# Altium schematic sheet Sheet1.SchDoc: SCHEMA
size A4; Date: 01/01/2000; Author: Rachid AKKOUCHE; CompanyName: RASoftware; DrawnBy: Rachid AKKOUCHE; Engineer: Rachid AKKOUCHE; Organization: RASoftware; Address1: 52J-03 rue de la crèche; Address3: 77100 MEAUX; Address4: FRANCE; DocumentNumber: 01; Revision: A; SheetNumber: 1; SheetTotal: 1; Dessinepar: Rachid AKKOUCHE; Property: RASoftware; Time: 00:00; ProjectName: Projet BRA; Application_BuildNumber: 01
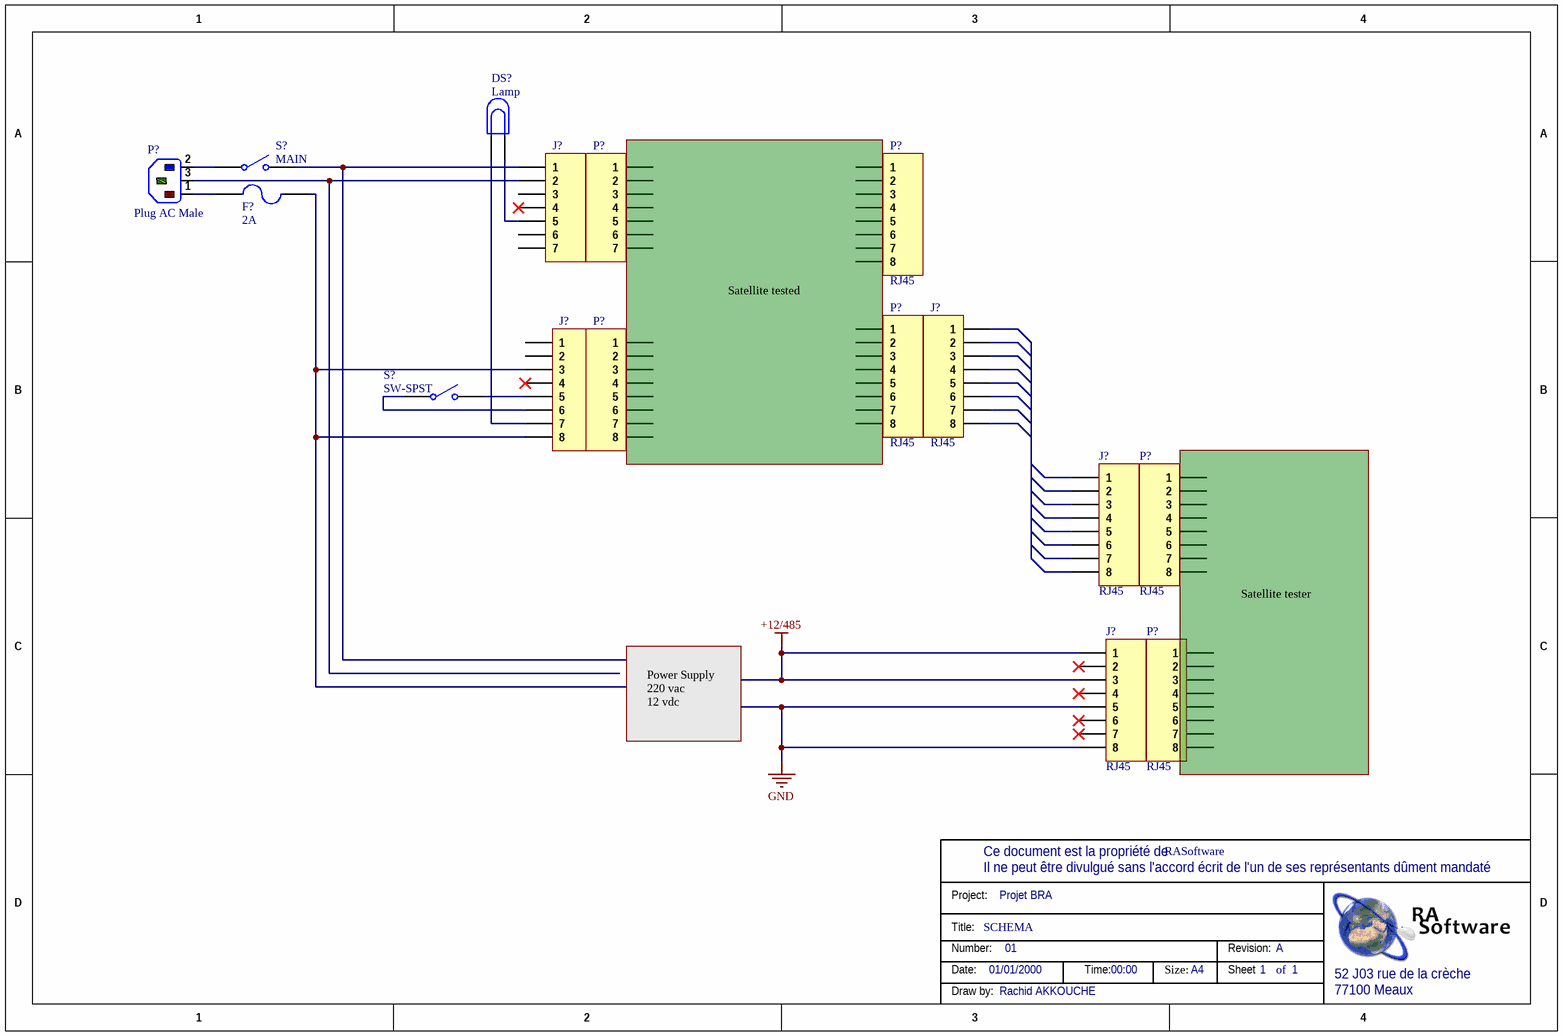
[diagram p0: Sheet1.SchDoc]

## Parts
(Parts that share a designator on the sheet are numbered #1, #2 ... from top to bottom, then left to right.)
DS?  Lamp  [PIN2]
F?  2A  [PIN-W2/E2.8]
J?#1  Header 7  [CO7P508-90]  (value not drawn)
J?#2  RJ45  [AMPHENOL-RJ45_8]
J?#3  Header 8  [CO8P508 - 90°]  (value not drawn)
J?#4  RJ45  [AMPHENOL-RJ45_8]
J?#5  RJ45  [AMPHENOL-RJ45_8]
P?#1  Header 7  [CO7P508-90]  (value not drawn)
P?#2  RJ45  [AMPHENOL-RJ45_8]
P?#3  Plug AC Male  [IEC9.14-2H3]
P?#4  RJ45  [AMPHENOL-RJ45_8]
P?#5  Header 8  [CO8P508 - 90°]  (value not drawn)
P?#6  RJ45  [AMPHENOL-RJ45_8]
P?#7  RJ45  [AMPHENOL-RJ45_8]
S?#1  MAIN  [SPST-2]
S?#2  SW-SPST  [SPST-2]

## Nets
+12/485: J?#5.1 J?#5.3
GND: J?#5.5 J?#5.8
NetDS?_1: DS?.1 J?#3.7
NetDS?_2: DS?.2 J?#1.5
NetF?_1: F?.1 P?#3.1(L)
NetF?_2: F?.2 J?#3.3 J?#3.8
NetJ?#1_1: J?#1.1 S?#1.2(NO)
NetJ?#1_2: J?#1.2 P?#3.3(E)
NetJ?#3_5: J?#3.5 S?#2.2(NO)
NetJ?#3_6: J?#3.6 S?#2.1(COMMON)
NetP?#3_2: P?#3.2(N) S?#1.1(COMMON)

Not connected (* = marked no-connect by the designer): J?#1 3 4* 6 7; J?#2 1 2 3 4 5 6 7 8; J?#3 1 2 4*; J?#4 1 2 3 4 5 6 7 8; J?#5 2* 4* 6* 7*; P?#1 1 2 3 4 5 6 7; P?#2 1 2 3 4 5 6 7 8; P?#4 1 2 3 4 5 6 7 8; P?#5 1 2 3 4 5 6 7 8; P?#6 1 2 3 4 5 6 7 8; P?#7 1 2 3 4 5 6 7 8

## Notes on the sheet
- Satellite tested
- Satellite tester
- Power Supply
  220 vac
  12 vdc
- Ce document est la propriété de
- Project:
- Il ne peut être divulgué sans l'accord écrit de l'un de ses représentants dûment mandaté
- Title:
- Number:
- Date:
- Time:
- Size:
- A4
- Revision:
- Sheet
- of
- 52 J03 rue de la crèche
- Draw by:
- 77100 Meaux

## Library data of the parts
DS? = Lamp: Incandescent Bulb; Published: 24-Mar-1999; LatestRevisionDate: 17-Jul-2002; LatestRevisionNote: Re-released for DXP Platform.; PackageReference: PIN2; Publisher: Altium Limited
F? = Fuse 2: Fuse; Published: 8-Jun-2000; LatestRevisionDate: 17-Jul-2002; LatestRevisionNote: Re-released for DXP Platform.; PackageReference: PIN-W2/E2.8; Publisher: Altium Limited; PackageDescription: Thru-Hole; 2 Leads
J?#1 P?#1 = Header 7: Header, 7-Pin; Manufacturer: FCI; Manufacturer Part Number: 20020110-H071A01LF; Anschlussart: Löten; Anzahl der Kontakte: 7; Anzahl der Reihen: 1; Betriebsspannung: 300 V ac; Breite: 12mm; Farbe: Grün; Gehäuseausrichtung: Rechtwinklig; Gender: Male; Länge: 37.56mm; Montagetyp: Durchsteckmontage; Nennstrom: 12A; Raster: 5.08mm; Serie: 06-508; Tiefe: 8.5mm; Typ: Stiftsockel; Currency: ÿNILÿ; Product StockNumber: 707-5477; Connecteur femelle: 790-0714; LatestRevisionDate: 17-Jul-2002; LatestRevisionNote: Re-released for DXP Platform.; Publisher: Altium Limited; Supplier 1: RS-Components; Supplier Part Number 1: 707-5477; RoHS: Compliant; Category: Steckverbinder; Stock 1: 0; Pricing 1: 5=0,778, 375=0,682, 1250=0,584, 2500=0,486, 5000=0,39 (ÿNILÿ); Material: Nylon; Product Status: ÿNILÿ; Future Stock Date: ÿNILÿ
J?#2 J?#4 J?#5 P?#2 P?#4 P?#6 P?#7 = Header 8: Header, 8-Pin; Manufacturer: MOLEX; Manufacturer Part Number: 85513-5013; Genre: Embase; Nombre de contacts: 8; Nombre de ports: 1; Catégorie LAN: Cat3; Terminaison du contact: Montage en surface vertical; Plaquage du contact: Or; Matériau du contact: Bronze phosphoreux; Approval Category: UL 94V-0; Couleur: Black; Courant: 1.5; Force diélectrique, Vca: 1000; Inflammabilité: UL94V-0; Largeur (externe): 15.9; Longueur/hauteur: 13; Matière: Glass Filled LCP; Profondeur: 18.8; Résistance d'isolement: 500; Résistance, contact: 20; Température de fonctionnement max..: 80; Température d'utilisation min: -40; Tension c.a.: 125; Supplier 1: Farnell; Supplier Part Number 1: 1345055; RoHS: YES; Pricing 1: 1=0,98, 10=0,92, 50=0,86, 100=0,74 (EUR); Type de connecteur: RJ45; Nombre de positions: 8; Body Plating: Or; Nombre de voies: 8; ComponentLink1URL: http://www.farnell.com/cad/1734187.pdf; ComponentLink1Description: http://www.farnell.com/cad/1734187.pdf; ComponentLink2URL: http://www.farnell.com/datasheets/1733622.pdf; ComponentLink2Description: http://www.farnell.com/datasheets/1733622.pdf
J?#3 P?#5 = Header 8: Header, 8-Pin; Manufacturer: CAMDENBOSS; Manufacturer Part Number: CTB9350/8AO; Gamme de produit: CAMDENBOSS - CTB9350; Type de terminaison de contact: Traversant; Genre: Mâle; Nombre de contacts: 8; Nombre de rangées: 1; Pas: 5; Plaquage du contact: Cuivre; Matériau du contact: Laiton; SVHC: No SVHC (16-Jun-2014); Couleur: vert; Courant: 12; Inflammabilité: UL94V-0; Matériau, vis: Acier; Méthode de terminaison: A souder; Taille du filetage: M3; Température de fonctionnement max..: 125; Température d'utilisation min: -20; Tension nominale Vac: 380; Terminaison du contact: Traversant à angle droit<!--FANDB--><div class="features-and-benefits-container"></div>; Connecteur femelle: 3881891; LatestRevisionDate: 17-Jul-2002; LatestRevisionNote: Re-released for DXP Platform.; Publisher: Altium Limited; Supplier 1: Farnell; Supplier Part Number 1: 3882251; RoHS: YES; Pricing 1: 1=0,963, 25=0,847, 100=0,793, 250=0,732, 700=0,659, 3000=0,581, 3000=0,523, 20000=0,471 (EUR); ComponentLink1URL: http://www.farnell.com/datasheets/1708040.pdf; ComponentLink1Description: http://www.farnell.com/datasheets/1708040.pdf
P?#3 = Plug AC Male: IEC Mains Power Inlet, EN60 320-1 C14 Class I Cold Condition, PC Flange Rear Mount, Chassis Plug; PackageDocument: ver.80, 15-Sep-2003; MaximumRating: 10A, 250V a.c. (UL & CSA 15A, 250V a.c.); MountingFixtures: Not drawn on schematic symbol.; PCB_Layout: Complies with manufacturer's recommendation.; DrillSize: Corresponds to nominal value.; Note: IEC Color Scheme employed for L, N and E.; Published: 15-Jul-2004; LatestRevisionDate: 15-Jul-2004; LatestRevisionNote: Component Replaced.; DatasheetDocument: ver.80, 15-Sep-2003; PackageReference: PX0580/PC; Publisher: Altium Limited; Terminations: P.C. Spills; ComponentLink1Description: Manufacturer Link; ComponentLink1URL: http://www.bulgin.co.uk/
S?#1 S?#2 = SW-SPST: Single-Pole, Single-Throw Switch; Published: 24-Mar-1999; LatestRevisionDate: 17-Jul-2002; LatestRevisionNote: Re-released for DXP Platform.; PackageReference: SPST-2; Publisher: Altium Limited; PackageDescription: Switch; 2 Leads